# Altium schematic sheet VĐK.SchDoc
size A4; SheetNumber: 4; SheetTotal: 4
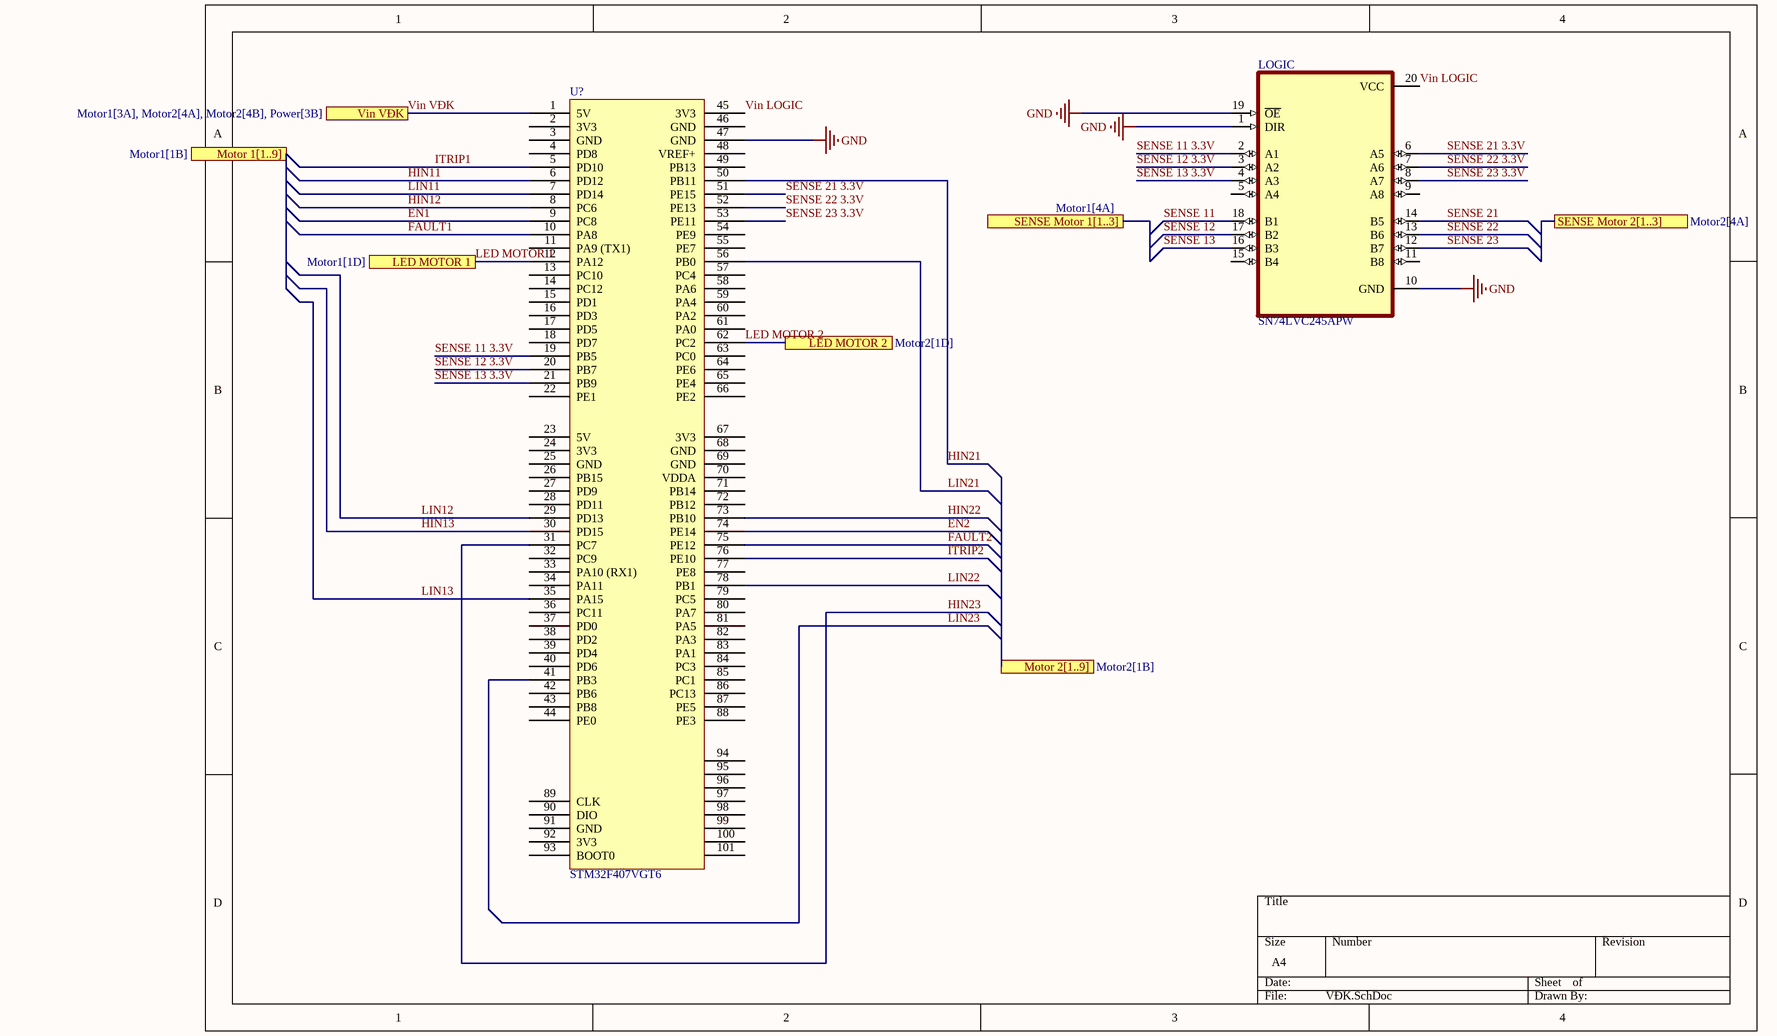
[diagram p0: VĐK.SchDoc]

## Parts
LOGIC  SN74LVC245APW  [SOP65P640X120-20N]
U?  STM32F407VGT6  [STM32F407VGT6]

## Ports
LED MOTOR 1 (see Motor1[1D]), LED MOTOR 2 (see Motor2[1D]), Motor 1[1..9] (see Motor1[1B]), Motor 2[1..9] (see Motor2[1B]), SENSE Motor 1[1..3] (see Motor1[4A]), SENSE Motor 2[1..3] (see Motor2[4A]), Vin VĐK (see Motor1[3A], Motor2[4A], Motor2[4B], Power[3B])

## Nets
GND: LOGIC.1(DIR) LOGIC.10(GND) LOGIC.19(~{OE}) U?.47(GND)
EN1: U?.9(PC8)
EN2: U?.74(PE14)
FAULT1: U?.10(PA8)
FAULT2: U?.75(PE12)
HIN11: U?.6(PD12)
HIN12: U?.8(PC6)
HIN13: U?.30(PD15)
HIN21: U?.50(PB11)
HIN22: U?.73(PB10)
HIN23: U?.31(PC7)
ITRIP1: U?.5(PD10)
ITRIP2: U?.76(PE10)
LED MOTOR 1: U?.12(PA12) ; port LED MOTOR 1
LED MOTOR 2: U?.62(PC2) ; port LED MOTOR 2
LIN11: U?.7(PD14)
LIN12: U?.29(PD13)
LIN13: U?.35(PA15)
LIN21: U?.56(PB0)
LIN22: U?.78(PB1)
LIN23: U?.41(PB3)
SENSE 11: LOGIC.18(B1)
SENSE 11 3.3V: LOGIC.2(A1) U?.19(PB5)
SENSE 12: LOGIC.17(B2)
SENSE 12 3.3V: LOGIC.3(A2) U?.20(PB7)
SENSE 13: LOGIC.16(B3)
SENSE 13 3.3V: LOGIC.4(A3) U?.21(PB9)
SENSE 21: LOGIC.14(B5)
SENSE 21 3.3V: LOGIC.6(A5) U?.51(PE15)
SENSE 22: LOGIC.13(B6)
SENSE 22 3.3V: LOGIC.7(A6) U?.52(PE13)
SENSE 23: LOGIC.12(B7)
SENSE 23 3.3V: LOGIC.8(A7) U?.53(PE11)
Vin LOGIC: LOGIC.20(VCC) U?.45(3V3)
Vin VĐK: U?.1(5V) ; port Vin VĐK

Not connected (* = marked no-connect by the designer): LOGIC 5(A4) 9(A8) 11(B8) 15(B4); U? 2(3V3) 3(GND) 4(PD8) 11(PA9_(TX1)) 13(PC10) 14(PC12) 15(PD1) 16(PD3) 17(PD5) 18(PD7) 22(PE1) 23(5V) 24(3V3) 25(GND) 26(PB15) 27(PD9) 28(PD11) 32(PC9) 33(PA10_(RX1)) 34(PA11) 36(PC11) 37(PD0) 38(PD2) 39(PD4) 40(PD6) 42(PB6) 43(PB8) 44(PE0) 46(GND) 48(VREF+) 49(PB13) 54(PE9) 55(PE7) 57(PC4) 58(PA6) 59(PA4) 60(PA2) 61(PA0) 63(PC0) 64(PE6) 65(PE4) 66(PE2) 67(3V3) 68(GND) 69(GND) 70(VDDA) 71(PB14) 72(PB12) 77(PE8) 79(PC5) 80(PA7) 81(PA5) 82(PA3) 83(PA1) 84(PC3) 85(PC1) 86(PC13) 87(PE5) 88(PE3) 89(CLK) 90(DIO) 91(GND) 92(3V3) 93(BOOT0) 94 95 96 97 98 99 100 101

## Library data of the parts
LOGIC = SN74LVC245APW: Octal Bus Transceiver With 3-State Outputs 20-TSSOP -40 to 125; MF: Texas Instruments; Package: TSSOP-20 Texas Instruments; MP: SN74LVC245APW; Price: None; Availability: Warning; Purchase-URL: https://pricing.snapeda.com/search/part/SN74LVC245APW/?ref=eda; Check_prices: https://www.snapeda.com/parts/SN74LVC245APW/Texas%20Instruments/view-part/318075/?ref=eda; Value: *; SnapEDA_Link: https://www.snapeda.com/parts/SN74LVC245APW/Texas%20Instruments/view-part/318075/?ref=snap